# Altium project WB-AV-4506-T7BR.PrjPcb
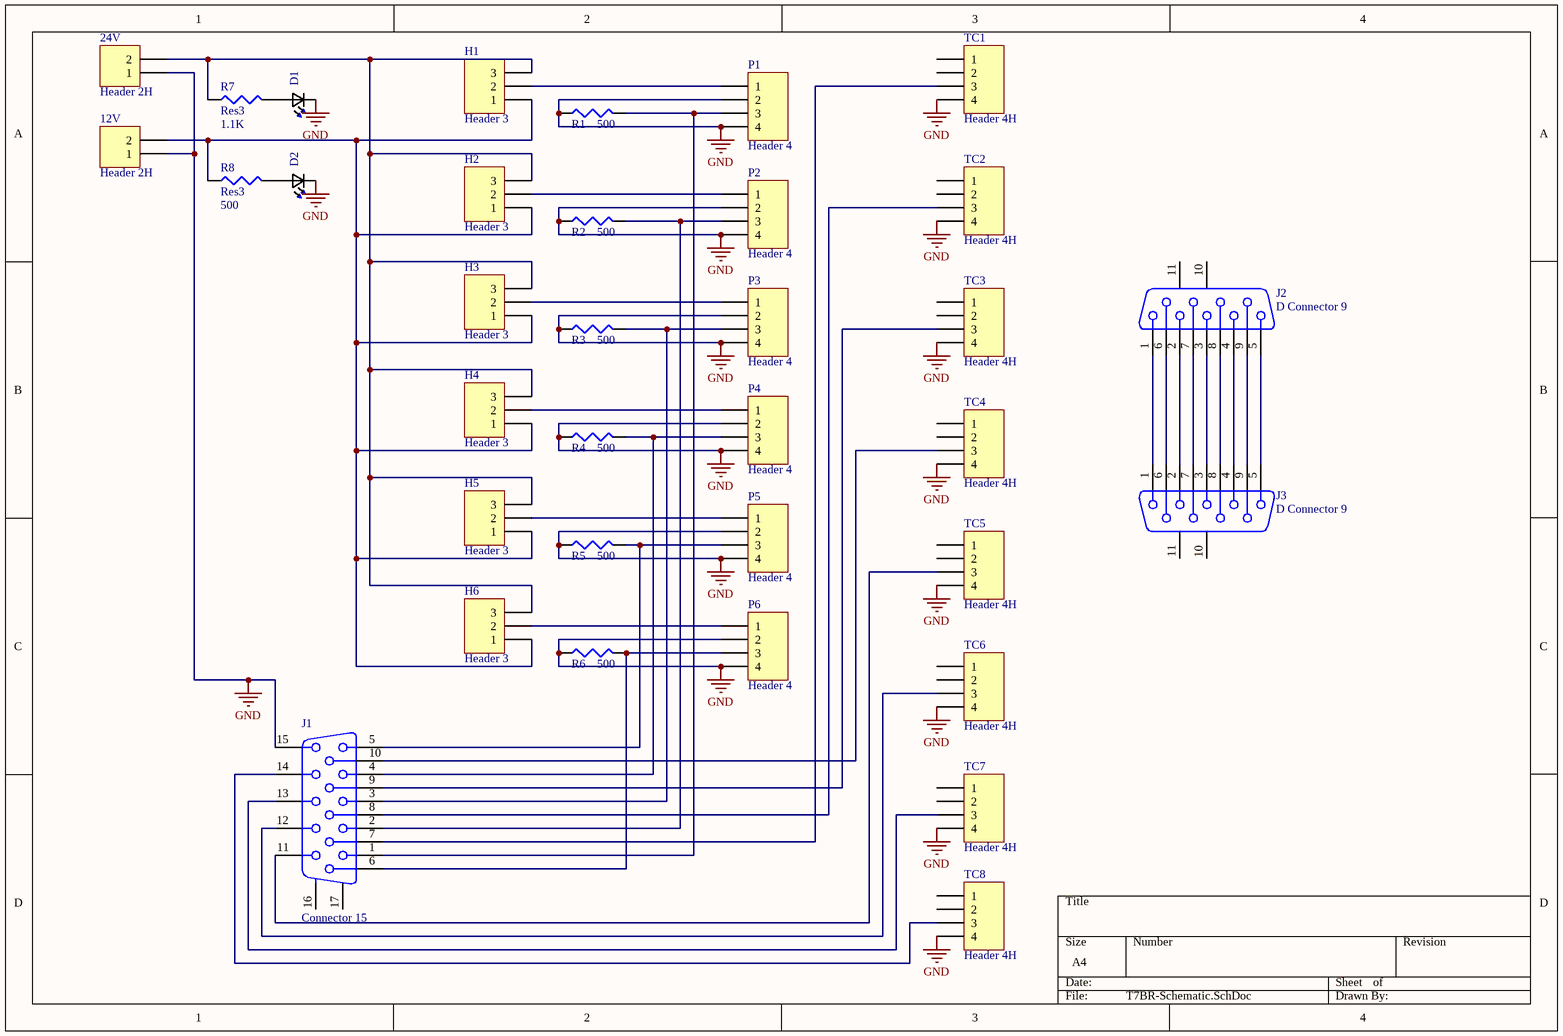
[diagram p0: T7BR-Schematic.SchDoc]
1 sheet, 35 parts. Net scope: global (net labels, ports and power ports of the same name join across sheets).
Board file: T7BR-PCB.PcbDoc

## Sheet T7BR-Schematic.SchDoc
size A4

### Parts
12V  Header 2H  [WM4900-ND]
24V  Header 2H  [WM4900-ND]
D1  (no value)  [*0603]
D2  (no value)  [*0603]
H1  Header 3  [HDR1X3]
H2  Header 3  [HDR1X3]
H3  Header 3  [HDR1X3]
H4  Header 3  [HDR1X3]
H5  Header 3  [HDR1X3]
H6  Header 3  [HDR1X3]
J1  Connector 15  [DSUB_15]
J2  D Connector 9  [DSUB_9]
J3  D Connector 9  [DSUB_9]
P1  Header 4  [WM4900-ND-4]
P2  Header 4  [WM4900-ND-4]
P3  Header 4  [WM4900-ND-4]
P4  Header 4  [WM4900-ND-4]
P5  Header 4  [WM4900-ND-4]
P6  Header 4  [WM4900-ND-4]
R1  value 500  [J1-0603]
R2  value 500  [J1-0603]
R3  value 500  [J1-0603]
R4  value 500  [J1-0603]
R5  value 500  [J1-0603]
R6  value 500  [J1-0603]
R7  Res3  value 1.1K  [J1-0603]
R8  Res3  value 500  [J1-0603]
TC1  Header 4H  [Thermocouple F]
TC2  Header 4H  [Thermocouple F]
TC3  Header 4H  [Thermocouple F]
TC4  Header 4H  [Thermocouple F]
TC5  Header 4H  [Thermocouple F]
TC6  Header 4H  [Thermocouple F]
TC7  Header 4H  [Thermocouple F]
TC8  Header 4H  [Thermocouple F]

### Nets
GND: 12V.1 24V.1 D1.1(K2) D2.1(K2) J1.15 P1.2 P1.4 P2.2 P2.4 P3.2 P3.4 P4.2 P4.4 P5.2 P5.4 P6.2 P6.4 R1.1 R2.1 R3.1 R4.1 R5.1 R6.1 TC1.4 TC2.4 TC3.4 TC4.4 TC5.4 TC6.4 TC7.4 TC8.4
Net12V_2: 12V.2 H1.1 H2.1 H3.1 H4.1 H5.1 H6.1 R8.1
Net24V_2: 24V.2 H1.3 H2.3 H3.3 H4.3 H5.3 H6.3 R7.1
NetD1_2: D1.2(A2) R7.2
NetD2_2: D2.2(A2) R8.2
NetH1_2: H1.2 P1.1
NetH2_2: H2.2 P2.1
NetH3_2: H3.2 P3.1
NetH4_2: H4.2 P4.1
NetH5_2: H5.2 P5.1
NetH6_2: H6.2 P6.1
NetJ1_1: J1.1 P1.3 R1.2
NetJ1_2: J1.2 P2.3 R2.2
NetJ1_3: J1.3 P3.3 R3.2
NetJ1_4: J1.4 P4.3 R4.2
NetJ1_5: J1.5 P5.3 R5.2
NetJ1_6: J1.6 P6.3 R6.2
NetJ1_7: J1.7 TC1.3
NetJ1_8: J1.8 TC2.3
NetJ1_9: J1.9 TC3.3
NetJ1_10: J1.10 TC4.3
NetJ1_11: J1.11 TC5.3
NetJ1_12: J1.12 TC6.3
NetJ1_13: J1.13 TC7.3
NetJ1_14: J1.14 TC8.3
NetJ2_1: J2.1 J3.1
NetJ2_2: J2.2 J3.2
NetJ2_3: J2.3 J3.3
NetJ2_4: J2.4 J3.4
NetJ2_5: J2.5 J3.5
NetJ2_6: J2.6 J3.6
NetJ2_7: J2.7 J3.7
NetJ2_8: J2.8 J3.8
NetJ2_9: J2.9 J3.9

Not connected (* = marked no-connect by the designer): J1 16(MH1) 17(MH2); J2 10(MH1) 11(MH2); J3 10(MH1) 11(MH2); TC1 1 2; TC2 1 2; TC3 1 2; TC4 1 2; TC5 1 2; TC6 1 2; TC7 1 2; TC8 1 2

### Library data of the parts
12V 24V = Header 2H: Header, 2-Pin, Right Angle; LatestRevisionDate: 17-Jul-2002; LatestRevisionNote: Re-released for DXP Platform.; Publisher: Altium Limited
D1 D2 = LTST-C191KGKT: Green 571nm LED Indication - Discrete 2V 0603 _1608 Metric_; MF: Lite-On Inc.; Digi-Key_Part_Number: 160-1446-1-ND; MP: LTST-C191KGKT; SnapEDA_Link: https://www.snapeda.com/parts/LTST-C191KGKT/Lite-On%20Inc./view-part/48565/?ref=snap; Digi-Key_Purchase_URL: https://www.digikey.com/product-detail/en/lite-on-inc/LTST-C191KGKT/160-1446-1-ND/386834?utm_source=snapeda&utm_medium=aggregator&utm_campaign=symbol; Package: 0603 Lite-On; Value: *
H1-H6 = Header 3: Header, 3-Pin; LatestRevisionDate: 17-Jul-2002; LatestRevisionNote: Re-released for DXP Platform.; Publisher: Altium Limited
J1 = Connector 15: Receptacle Assembly, 15-Pin, Sim Line Connector; PackageDocument: B; Positions: 15; Gender: Receptacle Header; Published: 15-Jun-2001; LatestRevisionDate: 17-Jul-2002; LatestRevisionNote: Re-released for DXP Platform.; DatasheetDocument: 24-Nov-1999; PackageReference: 788574; Publisher: Altium Limited; Orientation: Right Angle
J2 J3 = D Connector 9: Receptacle Assembly, 9 Position, Right Angle; PackageDocument: O; Positions: 9; Published: 15-Jun-2001; LatestRevisionDate: 17-Jul-2002; LatestRevisionNote: Re-released for DXP Platform.; DatasheetDocument: 1-Sep-1999; PackageReference: 788750; Publisher: Altium Limited; Orientation: Right Angle; Gender: Receptacle
P1-P6 = Header 4: Header, 4-Pin; LatestRevisionDate: 17-Jul-2002; LatestRevisionNote: Re-released for DXP Platform.; Publisher: Altium Limited
R1-R8 = Res3: Resistor; Published: 8-Jun-2000; LatestRevisionDate: 29-May-2009; LatestRevisionNote: IPC-7351 Footprint Added.; PackageReference: J1-0603; Publisher: Altium Limited; PackageDescription: Chip Resistor
TC1-TC8 = Header 4H: Header, 4-Pin, Right Angle; pin to pad: 1>13 2>14 3>15 4>16; LatestRevisionDate: 17-Jul-2002; LatestRevisionNote: Re-released for DXP Platform.; Publisher: Altium Limited